# Altium schematic sheet OpenPack_BATMOD_V1p0_PWR.SchDoc
size A4; SheetNumber: 7; SheetTotal: 10; Title_: Local PSU
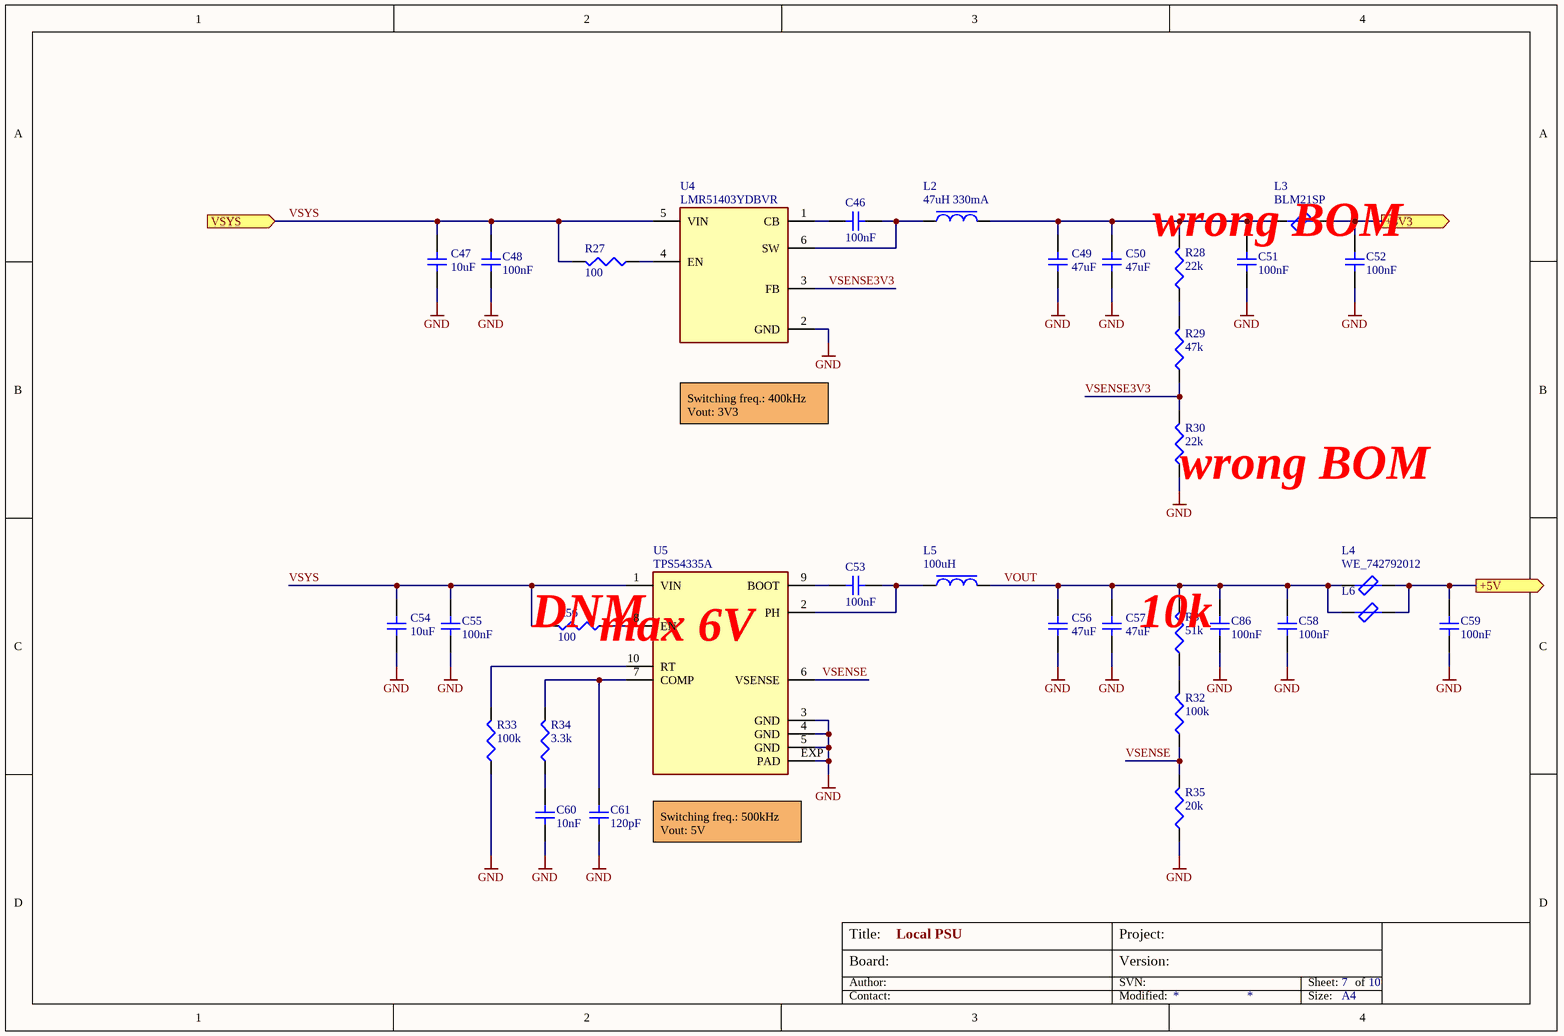
[diagram p0: OpenPack_BATMOD_V1p0_PWR.SchDoc]

## Parts
C46  100nF  [CAP_0603]
C47  10uF  [CAP_1210]
C48  100nF  [CAP_0603]
C49  47uF  [CAP_1210]
C50  47uF  [CAP_1210]
C51  100nF  [CAP_0603]
C52  100nF  [CAP_0603]
C53  100nF  [CAP_0603]
C54  10uF  [CAP_1210]
C55  100nF  [CAP_0603]
C56  47uF  [CAP_1210]
C57  47uF  [CAP_1210]
C58  100nF  [CAP_0603]
C59  100nF  [CAP_0603]
C60  10nF  [CAP_0603]
C61  120pF  [CAP_0603]
C86  100nF  [CAP_0603]
L2  47uH 330mA  [IND_1210]
L3  BLM21SP  [IND-0805]
L4  WE_742792012  [IND-0805]
L5  100uH  [IND_2]
L6  WE_742792012  [IND-0805]  (value not drawn)
R27  100  [RES-0603]
R28  22k  [RES-0603]
R29  47k  [RES-0603]
R30  22k  [RES-0603]
R31  51k  [RES-0603]
R32  100k  [RES-0603]
R33  100k  [RES-0603]
R34  3.3k  [RES-0603]
R35  20k  [RES-0603]
R56  100  [RES-0603]
U4  LMR51403YDBVR  [SOT-23-6]
U5  TPS54335A  [VSON-10]

## Ports
+3V3 (out, see OpenPack_BATMOD_V1p0_MAIN), +5V (out, see OpenPack_BATMOD_V1p0_MAIN), VSYS (in, see OpenPack_BATMOD_V1p0_MAIN, OpenPack_BATMOD_V1p0_CHRG, OpenPack_BATMOD_V1p0_USBA)

## Nets
GND: C47.1 C48.2 C49.1 C50.1 C51.2 C52.2 C54.1 C55.2 C56.1 C57.1 C58.2 C59.2 C60.2 C61.2 C86.2 R30.1 R33.1 R35.1 U4.2(GND) U5.3(GND) U5.4(GND) U5.5(GND) U5.EXP(PAD)
+3V3: C52.1 L3.2 ; port +3V3
+5V: C59.1 L4.2 L6.2 ; port +5V
VOUT: C56.2 C57.2 C58.1 C86.1 L4.1 L5.2 L6.1 R31.2
VSENSE: R32.1 R35.2 U5.6(VSENSE)
VSENSE3V3: R29.1 R30.2 U4.3(FB)
VSYS: C47.2 C48.1 C54.2 C55.1 R27.2 R56.2 U4.5(VIN) U5.1(VIN) ; port VSYS
NetC46_1: C46.1 L2.1 U4.6(SW)
NetC46_2: C46.2 U4.1(CB)
NetC49_2: C49.2 C50.2 C51.1 L2.2 L3.1 R28.2
NetC53_1: C53.1 L5.1 U5.2(PH)
NetC53_2: C53.2 U5.9(BOOT)
NetC60_1: C60.1 R34.1
NetC61_1: C61.1 R34.2 U5.7(COMP)
NetR27_1: R27.1 U4.4(EN)
NetR28_1: R28.1 R29.2
NetR31_1: R31.1 R32.2
NetR33_2: R33.2 U5.10(RT)
NetR56_1: R56.1 U5.8(EN)

## Notes on the sheet
- wrong BOM
- Switching freq.: 400kHz
  Vout: 3V3
- (near R30) wrong BOM
- (near R56) DNM
- max 6V
- (near R31) 10k
- Switching freq.: 500kHz
  Vout: 5V
- Board:
- Author:
- Title:
- Project:
- SVN:
- Version:
- Sheet:
- of
- Contact:
- Modified:
- Size:
- A4

## Library data of the parts
C46 C48 C51-C53 C55 C58-C61 C86 = NP-CAPACITOR: MLCC capacitor; Type: CAP
C47 C54 = NP-CAPACITOR: UMK325BJ106KM-P; Part number: 810-CGA6P1X7R1N106K2; Type: CAP; Supplier: Mouser
C49 C50 C56 C57 = NP-CAPACITOR: Np-Cap; Part number: 80-C1210C476M4P; Type: CAP; Supplier: Mouser
L2 = Inductance - 47uH: Power inductor; Part number: 81-LQH32PN470MN0L; Type: IND; Supplier: Mouser; ComponentLink1Description: Datasheet; ComponentLink2Description: Order; ComponentLink2URL: https://hu.mouser.com/en/ProductDetail/Murata-Electronics/LQH32PN470MN0L?qs=18WYLvqSxErKIEyluVLVKQ%3D%3D
L3 = BLM21SP102SN1D: Chip Ferrite Bead, 1000R @100MHz, 1.6A; Part number: 81-BLM21SP102SN1D; Type: IND; Supplier: Mouser; ComponentLink1Description: Datasheet; ComponentLink1URL: ENFA0005-1915781.pdf; ComponentLink2Description: Order; ComponentLink2URL: https://hu.mouser.com/ProductDetail/Murata-Electronics/BLM21SP102SN1D?qs=17u8i%2FzlE88oj6hmj%252BXptA%3D%3D
L4 L6 = WE_742792012: Chip Ferrite Bead, 33R @100MHz, 4A; Part number: 710-742792012; Type: IND; Supplier: Mouser; ComponentLink1Description: Datasheet; ComponentLink2Description: Order; ComponentLink2URL: https://hu.mouser.com/en/ProductDetail/Wurth-Elektronik/742792012?qs=J4sk5G6CMwb1B4GP%2Fe%2FxmA%3D%3D
L5 = Inductance - 22uH: Ferrit core coil, 22uH 2.85A, 75mR; Part number: 994-MSS1038T-223MLC; Type: IND; Supplier: Mouser; ComponentLink1Description: Datasheet; ComponentLink2Description: Order; ComponentLink2URL: https://hu.mouser.com/en/ProductDetail/Coilcraft/MSS1038T-223MLC?qs=zCSbvcPd3pYngswiQ3YHhA%3D%3D
R27-R35 R56 = RESISTOR: Metal Film Resistor; Type: RES
U4 = LMR51403YDBVR: Switching Voltage Regulators 4.5V-to-42V 0.3A syn chronous buck conve; Part number: 595-LMR51403YDBVR; Supplier: Mouser; ComponentLink1Description: Datasheet; ComponentLink2Description: Order; ComponentLink2URL: https://hu.mouser.com/en/ProductDetail/Texas-Instruments/LMR51403YDBVR?qs=a2MtRaTmNOSR%252BGtnOaFIVg%3D%3D; Type: PWR-REG
U5 = TPS54335A: Switching Voltage Regulators 4.5Vto28VInp 3A Sync Step-Down Converter A 595-TPS54335ADRCT; Part number: 595-TPS54335ADRCR; Supplier: Mouser; ComponentLink1Description: Datasheet; ComponentLink2Description: Order; ComponentLink2URL: https://hu.mouser.com/en/ProductDetail/Texas-Instruments/TPS54335ADRCR?qs=ADSrZYdIRCdK%252Bcxbafh6hw%3D%3D; Type: PWR-REG